# Altium schematic sheet Sheet12.SchDoc
size A4
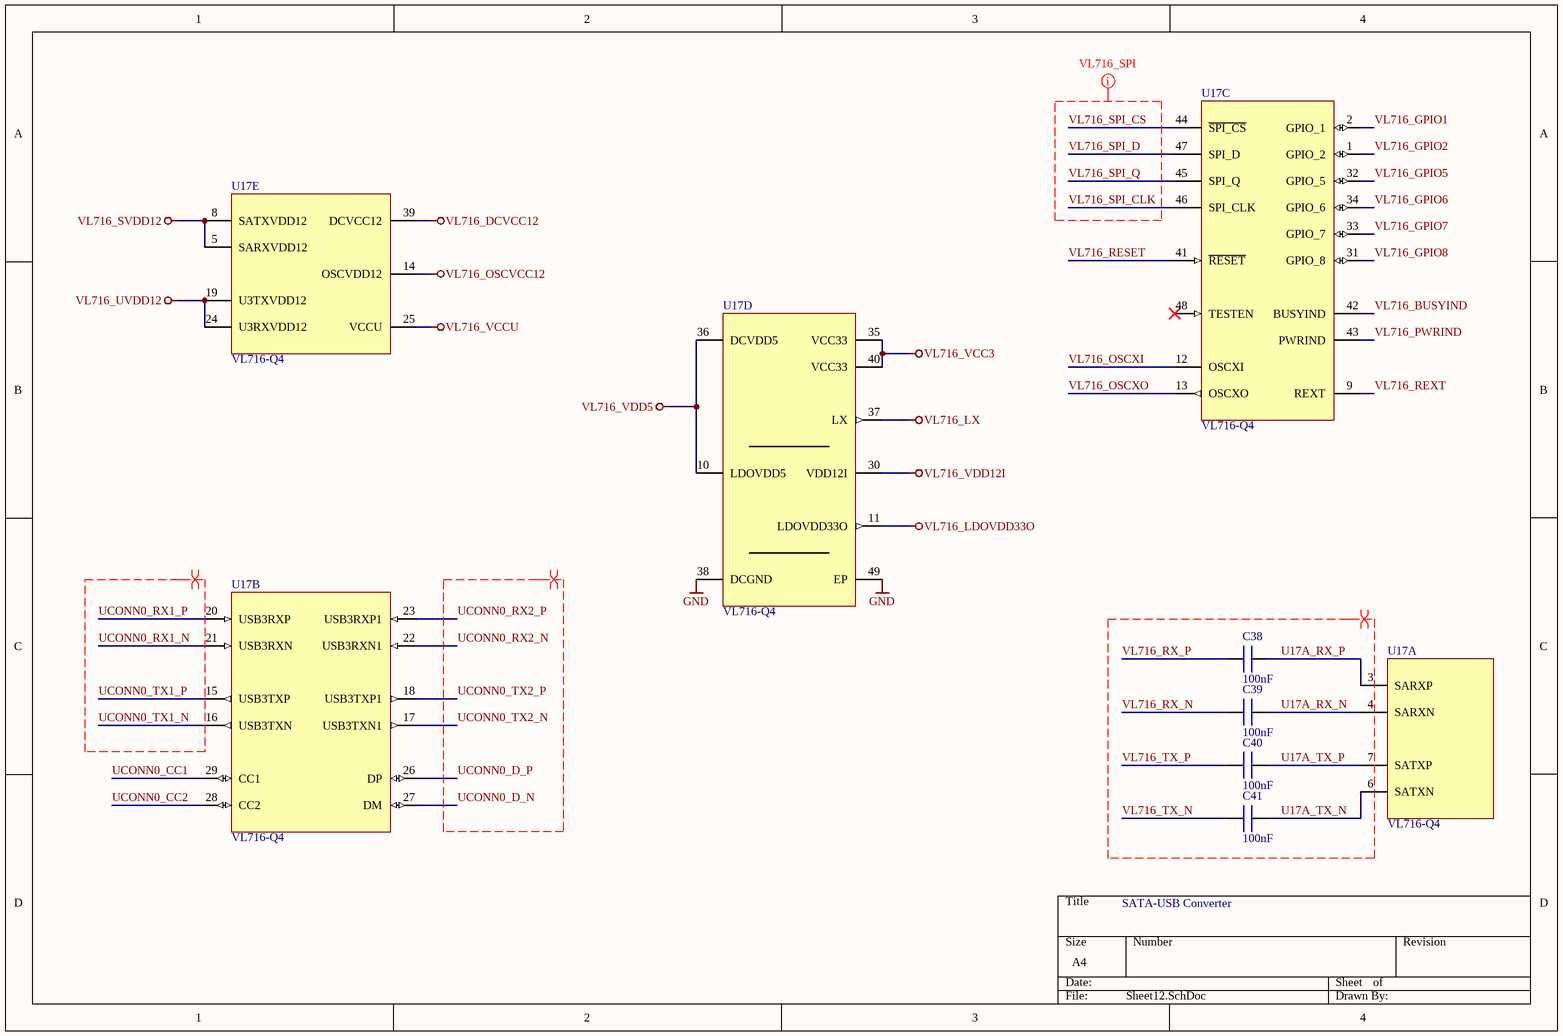
[diagram p0: Sheet12.SchDoc]

## Parts
C38  100nF  [CAPC1005X05N]
C39  100nF  [CAPC1005X05N]
C40  100nF  [CAPC1005X05N]
C41  100nF  [CAPC1005X05N]
U17  VL716-Q4  [VL716-Q4]  (parts A,B,C,D,E of 5)

## Nets
GND: U17.38(DCGND) U17.49(EP)
VL716_DCVCC12: U17.39(DCVCC12)
VL716_LDOVDD33O: U17.11(LDOVDD33O)
VL716_LX: U17.37(LX)
VL716_OSCVCC12: U17.14(OSCVDD12)
VL716_SVDD12: U17.5(SARXVDD12) U17.8(SATXVDD12)
VL716_UVDD12: U17.19(U3TXVDD12) U17.24(U3RXVDD12)
VL716_VCC3: U17.35(VCC33) U17.40(VCC33)
VL716_VCCU: U17.25(VCCU)
VL716_VDD5: U17.10(LDOVDD5) U17.36(DCVDD5)
VL716_VDD12I: U17.30(VDD12I)
U17A_RX_N: C39.1 U17.4(SARXN)
U17A_RX_P: C38.1 U17.3(SARXP)
U17A_TX_N: C41.1 U17.6(SATXN)
U17A_TX_P: C40.1 U17.7(SATXP)
UCONN0_CC1: U17.29(CC1)
UCONN0_CC2: U17.28(CC2)
UCONN0_D_N: U17.27(DM)
UCONN0_D_P: U17.26(DP)
UCONN0_RX1_N: U17.21(USB3RXN)
UCONN0_RX1_P: U17.20(USB3RXP)
UCONN0_RX2_N: U17.22(USB3RXN1)
UCONN0_RX2_P: U17.23(USB3RXP1)
UCONN0_TX1_N: U17.16(USB3TXN)
UCONN0_TX1_P: U17.15(USB3TXP)
UCONN0_TX2_N: U17.17(USB3TXN1)
UCONN0_TX2_P: U17.18(USB3TXP1)
VL716_BUSYIND: U17.42(BUSYIND)
VL716_GPIO1: U17.2(GPIO_1)
VL716_GPIO2: U17.1(GPIO_2)
VL716_GPIO5: U17.32(GPIO_5)
VL716_GPIO6: U17.34(GPIO_6)
VL716_GPIO7: U17.33(GPIO_7)
VL716_GPIO8: U17.31(GPIO_8)
VL716_OSCXI: U17.12(OSCXI)
VL716_OSCXO: U17.13(OSCXO)
VL716_PWRIND: U17.43(PWRIND)
VL716_RESET: U17.41(~{RESET})
VL716_REXT: U17.9(REXT)
VL716_RX_N: C39.2
VL716_RX_P: C38.2
VL716_SPI_CLK: U17.46(SPI_CLK)
VL716_SPI_CS: U17.44(~{SPI_CS})
VL716_SPI_D: U17.47(SPI_D)
VL716_SPI_Q: U17.45(SPI_Q)
VL716_TX_N: C41.2
VL716_TX_P: C40.2

Not connected (* = marked no-connect by the designer): U17 48(TESTEN)*

## Layout directives
differential pair: U17A_RX_N, U17A_RX_P, U17A_TX_N, U17A_TX_P, UCONN0_D_N, UCONN0_D_P, UCONN0_RX1_N, UCONN0_RX1_P, UCONN0_RX2_N, UCONN0_RX2_P, UCONN0_TX1_N, UCONN0_TX1_P, UCONN0_TX2_N, UCONN0_TX2_P, VL716_RX_N, VL716_RX_P, VL716_TX_N, VL716_TX_P
net class VL716_SPI: VL716_SPI_CLK, VL716_SPI_CS, VL716_SPI_D, VL716_SPI_Q

## Notes on the sheet
- SATA-USB Converter

## Library data of the parts
C38-C41 = C0402: Ceramic Chip Capacitor; Value: 100nF
U17 = VL716-Q4: USB 3.1 to SATA 6Gb/s bridge controller with USB type-C connector support